# EAGLE schematic blue_pot_proto (EAGLE 7.7.0)
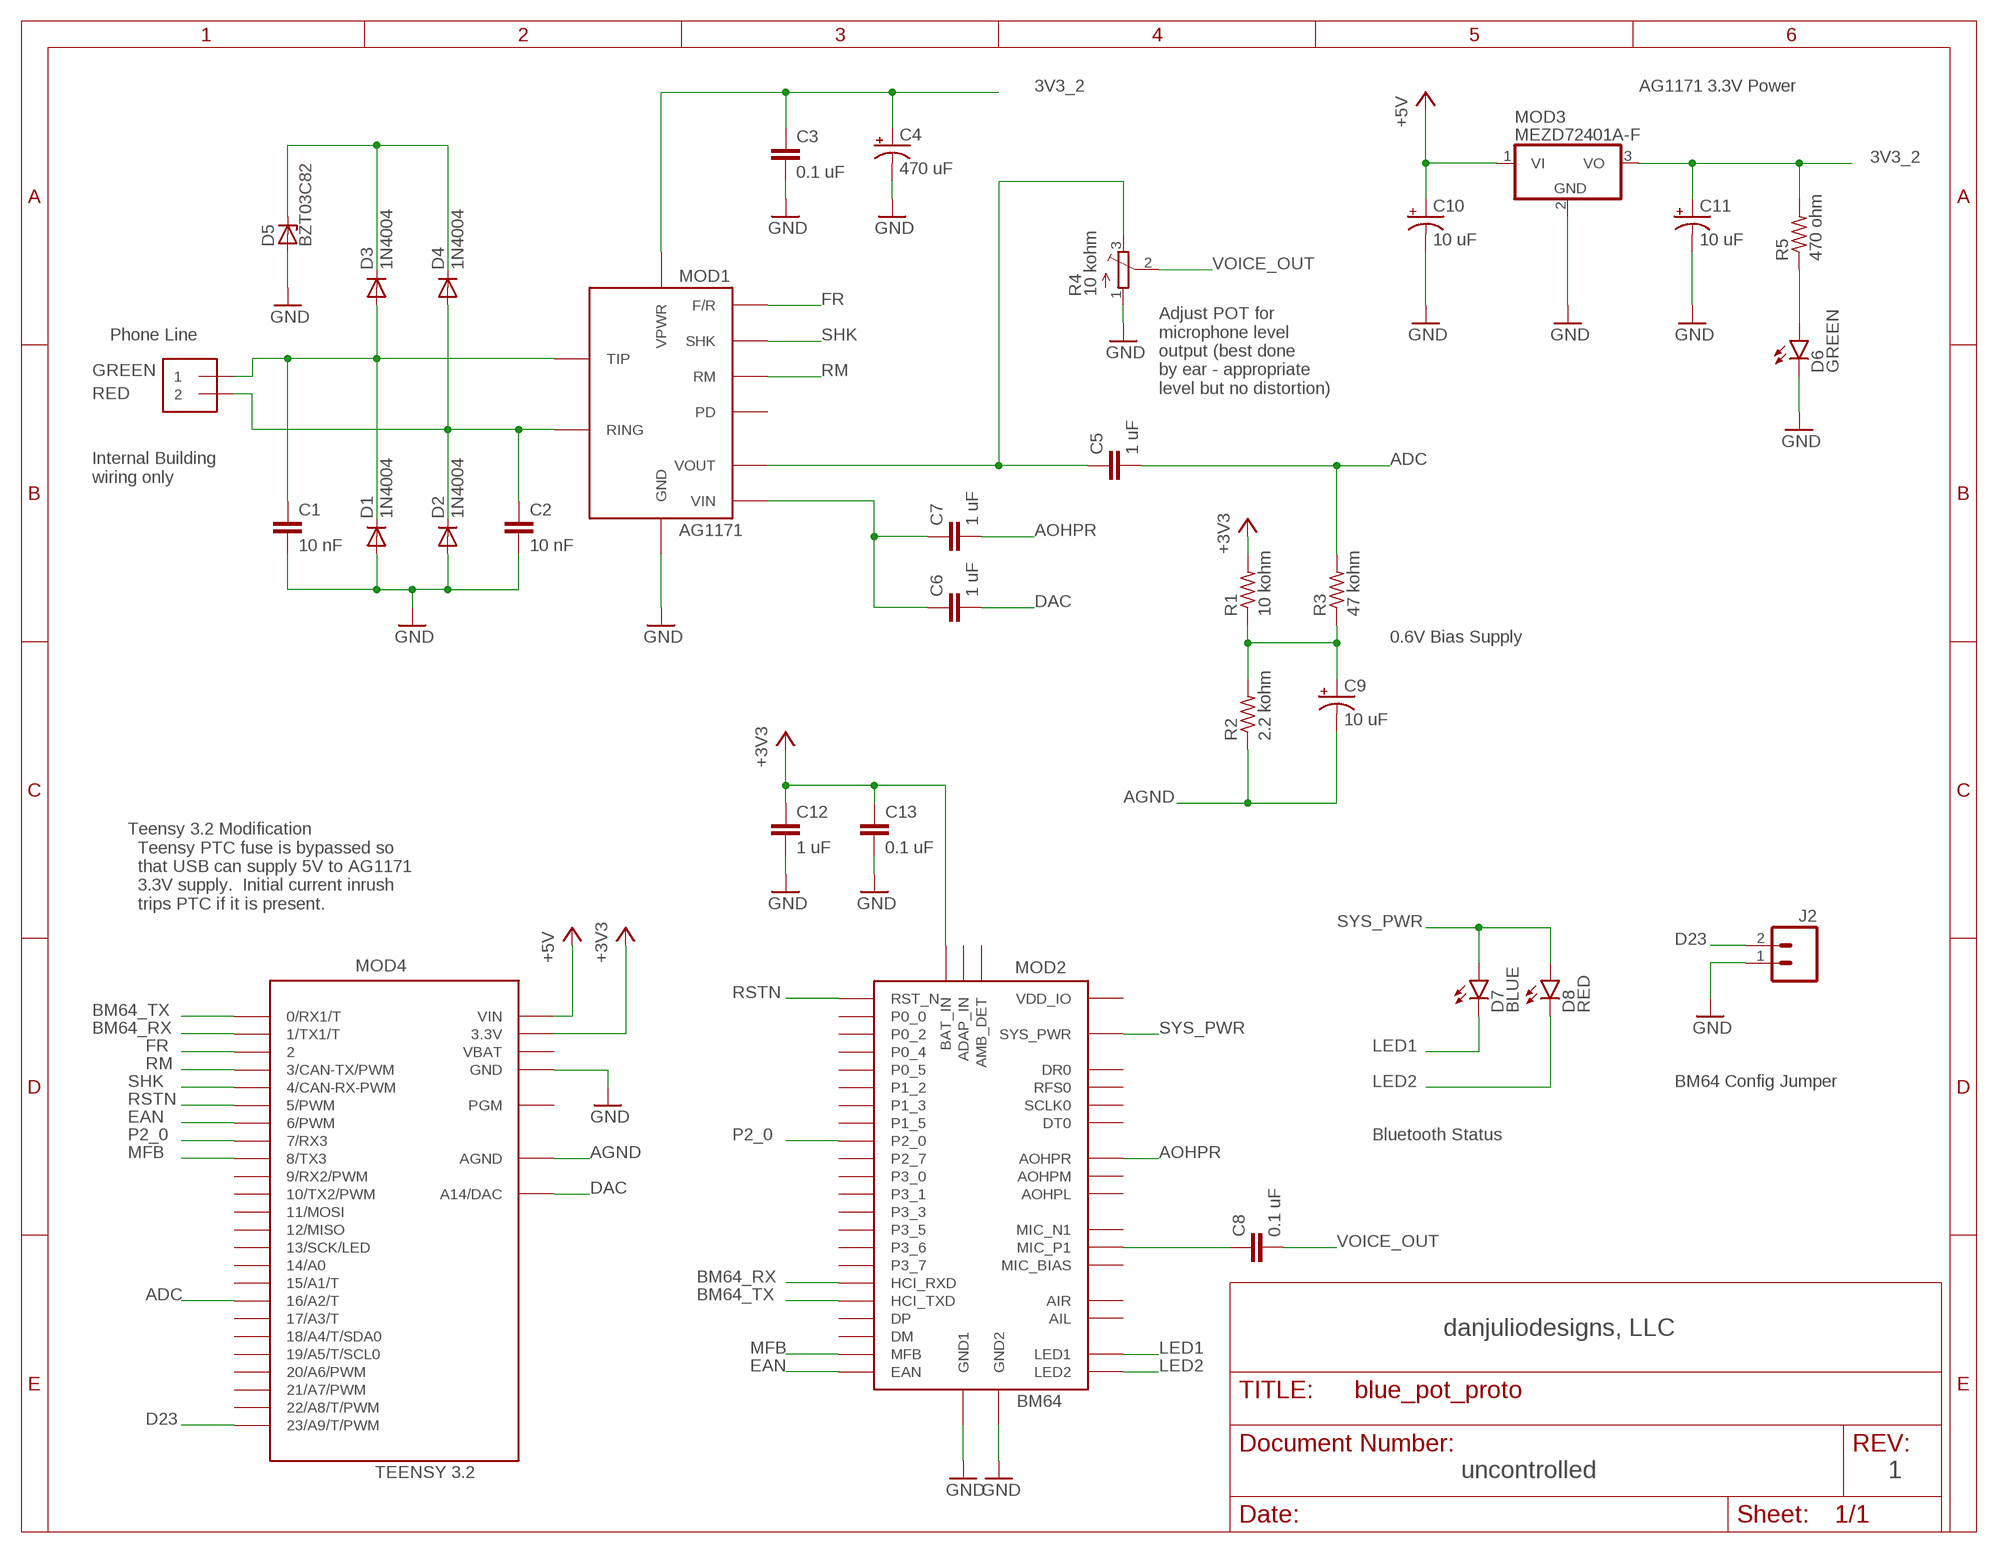
[diagram p0: schematic, sheet 1]

## Parts
C1  10 nF  C5/2.5  [C5B2.5]
C2  10 nF  C5/2.5  [C5B2.5]
C3  0.1 uF  C5/2.5  [C5B2.5]
C4  470 uF  CPOL-USTT5D10  [TT5D10]
C5  1 uF  C5/2.5  [C5B2.5]
C6  1 uF  C5/2.5  [C5B2.5]
C7  1 uF  C5/2.5  [C5B2.5]
C8  0.1 uF  C5/2.5  [C5B2.5]
C9  10 uF  CPOL-USTT2D5  [TT2D5]
C10  10 uF  CPOL-USTT2D5  [TT2D5]
C11  10 uF  CPOL-USTT2D5  [TT2D5]
C12  1 uF  C5/2.5  [C5B2.5]
C13  0.1 uF  C5/2.5  [C5B2.5]
D1  1N4004  [DO41-10]
D2  1N4004  [DO41-10]
D3  1N4004  [DO41-10]
D4  1N4004  [DO41-10]
D5  BZT03C82  BZT03XX  [SOD57Z10]
D6  GREEN  LED5MM  [LED5MM]
D7  BLUE  LED5MM  [LED5MM]
D8  RED  LED5MM  [LED5MM]
J1  1X2-3.5MM  [1X2-3.5MM]
J2  M02PTH  [1X02]
MOD1  AG1171  AG1171SIL  [AG1171]
MOD2  BM64  [BM64]
MOD3  MEZD72401A-F  7805T  [TO220H]
MOD4  TEENSY 3.2  TEENSY_3.1-3.2_OUTER_ROW  [TEENSY_3.0-3.2&LC_OUTER_ROW]
R1  10 kohm  R-US_0207/10  [0207/10]
R2  2.2 kohm  R-US_0207/10  [0207/10]
R3  47 kohm  R-US_0207/10  [0207/10]
R4  10 kohm  TRIMPOTTC33X  [TC33X]
R5  470 ohm  R-US_0207/10  [0207/10]

## Nets
3V3_2: C3.1 C4.+ C11.+ MOD1.P$13(VPWR) MOD3.3(VO)
+3V3: C12.1 C13.1 MOD2.22(BAT_IN) MOD4.3.3V MOD4.3.3V1(3.3V) R1.2
+5V: C10.+ MOD3.1(VI) MOD4.VIN
ADC: C5.2 MOD4.16/A2(16/A2/T) R3.2
AGND: C9.- MOD4.AGND R2.1
AOHPR: C7.2 MOD2.5(AOHPR)
BM64_RX: MOD2.19(HCI_RXD) MOD4.1(1/TX1/T)
BM64_TX: MOD2.20(HCI_TXD) MOD4.0(0/RX1/T)
D23: J2.2 MOD4.23/A9(23/A9/T/PWM)
DAC: C6.2 MOD4.RESET/DAC(A14/DAC)
EAN: MOD2.32(EAN) MOD4.6(6/PWM)
FR: MOD1.P$3(F/R) MOD4.2
GND: C1.2 C2.2 C3.2 C4.- C10.- C11.- C12.2 C13.2 D1.A D2.A D5.A D6.K(C) J2.1 MOD1.P$12(GND) MOD2.14(GND1) MOD2.43(GND2) MOD3.2(GND) MOD4.GND MOD4.GND1(GND) R4.1(A)
LED1: D7.K(C) MOD2.28(LED1)
LED2: D8.K(C) MOD2.27(LED2)
MFB: MOD2.26(MFB) MOD4.8(8/TX3)
N$1: C1.1 D1.C D3.A J1.1 MOD1.P$2(TIP)
N$2: C2.1 D2.C D4.A J1.2 MOD1.P$1(RING)
N$3: C8.1 MOD2.9(MIC_P1)
N$4: C6.1 C7.1 MOD1.P$9(VIN)
N$5: D3.C D4.C D5.C
N$6: C5.1 MOD1.P$10(VOUT) R4.3(E)
N$16: C9.+ R1.1 R2.2 R3.1
P2_0: MOD2.41(P2_0) MOD4.7(7/RX3)
RM: MOD1.P$4(RM) MOD4.3(3/CAN-TX/PWM)
RSTN: MOD2.13(RST_N) MOD4.5(5/PWM)
SHK: MOD1.P$5(SHK) MOD4.4(4/CAN-RX-PWM)
SYS_PWR: D7.A D8.A MOD2.24(SYS_PWR)
VOICE_OUT: C8.2 R4.2(S)
Unconnected: D6.A MOD1.P$14(PD) MOD2.1(DR0) MOD2.2(RFS0) MOD2.3(SCLK0) MOD2.4(DT0) MOD2.6(AOHPM) MOD2.7(AOHPL) MOD2.8(MIC_N1) MOD2.10(MIC_BIAS) MOD2.11(AIR) MOD2.12(AIL) MOD2.15(P1_2) MOD2.16(P1_3) MOD2.17(P0_4) MOD2.18(P1_5) MOD2.21(VDD_IO) MOD2.25(AMB_DET) MOD2.29(P3_7) MOD2.30(P3_5) MOD2.31(P0_0) MOD2.33(DM) MOD2.34(DP) MOD2.35(P0_5) MOD2.36(P3_0) MOD2.37(P3_1) MOD2.38(P3_3) MOD2.39(P3_6) MOD2.40(P0_2) MOD2.42(P2_7) MOD4.9(9/RX2/PWM) MOD4.10(10/TX2/PWM) MOD4.11(11/MOSI) MOD4.12(12/MISO) MOD4.13(13/SCK/LED) MOD4.14/A0 MOD4.15/A1(15/A1/T) MOD4.17/A3(17/A3/T) MOD4.18/A4(18/A4/T/SDA0) MOD4.19/A5(19/A5/T/SCL0) MOD4.20/A6(20/A6/PWM) MOD4.21/A7(21/A7/PWM) MOD4.22/A8(22/A8/T/PWM) MOD4.PGM R5.1 R5.2

## Notes on the sheet
- AG1171 3.3V Power
- Phone Line
- GREEN
- Adjust POT for
  microphone level
  output (best done
  by ear - appropriate
  level but no distortion)
- RED
- Internal Building
  wiring only
- 0.6V Bias Supply
- Teensy 3.2 Modification
    Teensy PTC fuse is bypassed so
    that USB can supply 5V to AG1171
    3.3V supply.  Initial current inrush
    trips PTC if it is present.
- BM64 Config Jumper
- Bluetooth Status
- danjuliodesigns, LLC
- uncontrolled | 1

## Power pins joined to a net without a drawn wire
ADAP_IN: MOD2.23(ADAP_IN)
VBAT: MOD4.VBAT

## Library data of the parts
C1-C3 C5-C8 C12 C13 = capacitor-wima:C: CAPACITOR naming: grid - package width
C4 C9-C11 = adafruit:CPOL-US: POLARIZED CAPACITOR, American symbol
D1-D4 = adafruit:1N4004: DIODE General purpose 1N400x type rectifier (With bigger pads) http://www.ladyada.net/library/pcb/eaglelibrary.html
D5 = diode:BZT03XX: Z DIODE
D6-D8 = SparkFun-LED:LED: LEDs Standard schematic elements and footprints for 5mm, 3mm, 1206, and 0603 sized LEDs. 5mm - Spark Fun Electronics SKU : COM-00529 (and others)
J1 = adafruit:1X2: 3.5mm Terminal block http://www.ladyada.net/library/pcb/eaglelibrary.html
J2 = SparkFun-Connectors:M02: Standard 2-pin 0.1" header. Use with - straight break away headers ( PRT-00116) - right angle break away headers (PRT-00553) - swiss pins (PRT-00743) - machine pins (PRT-00117) - female headers (PRT-00115) Molex polarized connector foot print use with: PRT-08233 with associated crimp pins and housings. 2.54_SCREWTERM for use with PRT-10571. 3.5mm Screw Terminal footprints for PRT-08084 5mm Screw Terminal footprints for use with PRT-08432
MOD1 = djd_eagle_library:AG1171: Silvertel AG1171 +3.3V / +5.0V Low Power Ringing SLIC
MOD2 = djd_eagle_library:BM64: Microchip BM64 Bluetooth Module
MOD3 = adafruit:78*: Positive VOLTAGE REGULATOR Added bigger pads to the TO-92 package
MOD4 = Teensy_3_and_LC_Series_Boards_v1.4:TEENSY_3.1-3.2_OUTER_ROW: Footprint for Teensy 3.1 or 3.2 board using all pin connections on the outer perimeter
R1-R3 R5 = adafruit:R-US_: RESISTOR, American symbol
R4 = adafruit:TRIMPOT: SMT trimmer potentiometer part number TC33X http://www.ladyada.net/library/eagle